# EAGLE board VerdiRT7_MainPCB (EAGLE 8.5.2), part 1 of 2
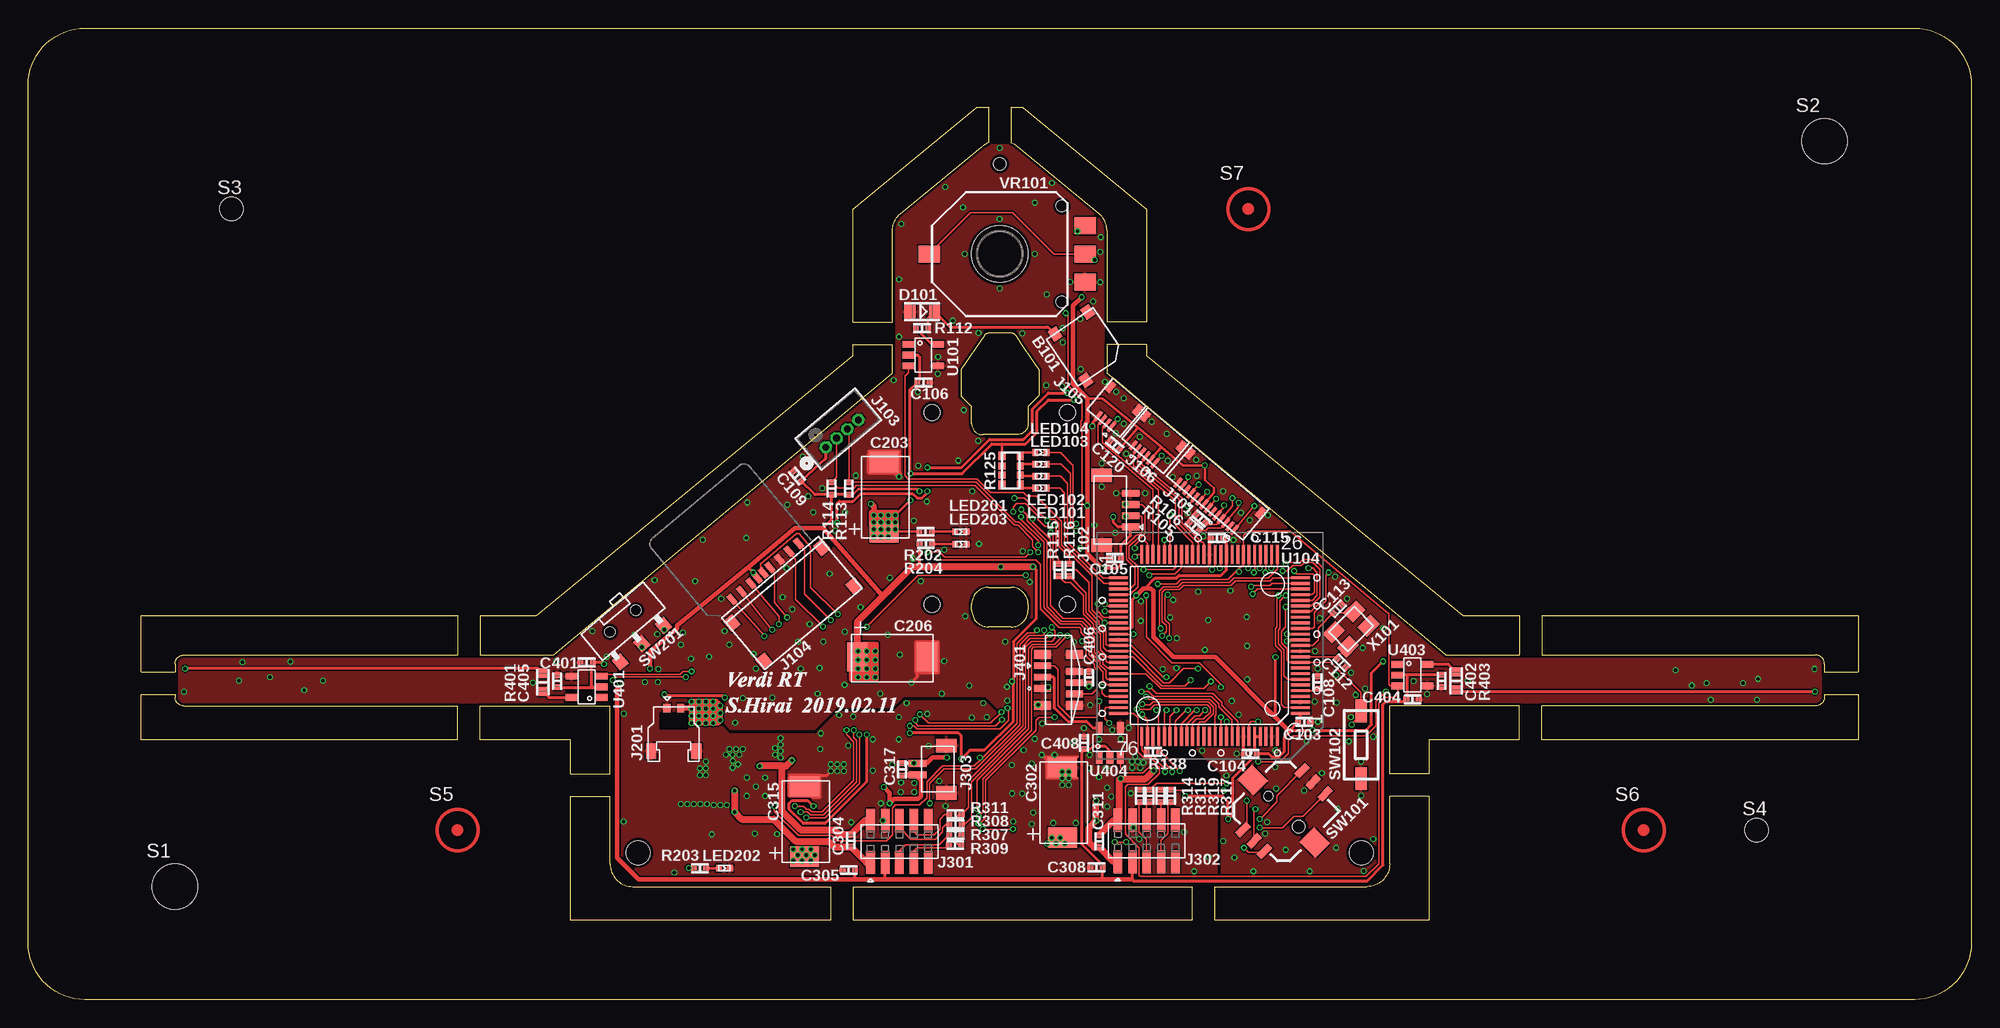
[diagram p6: board, top side]
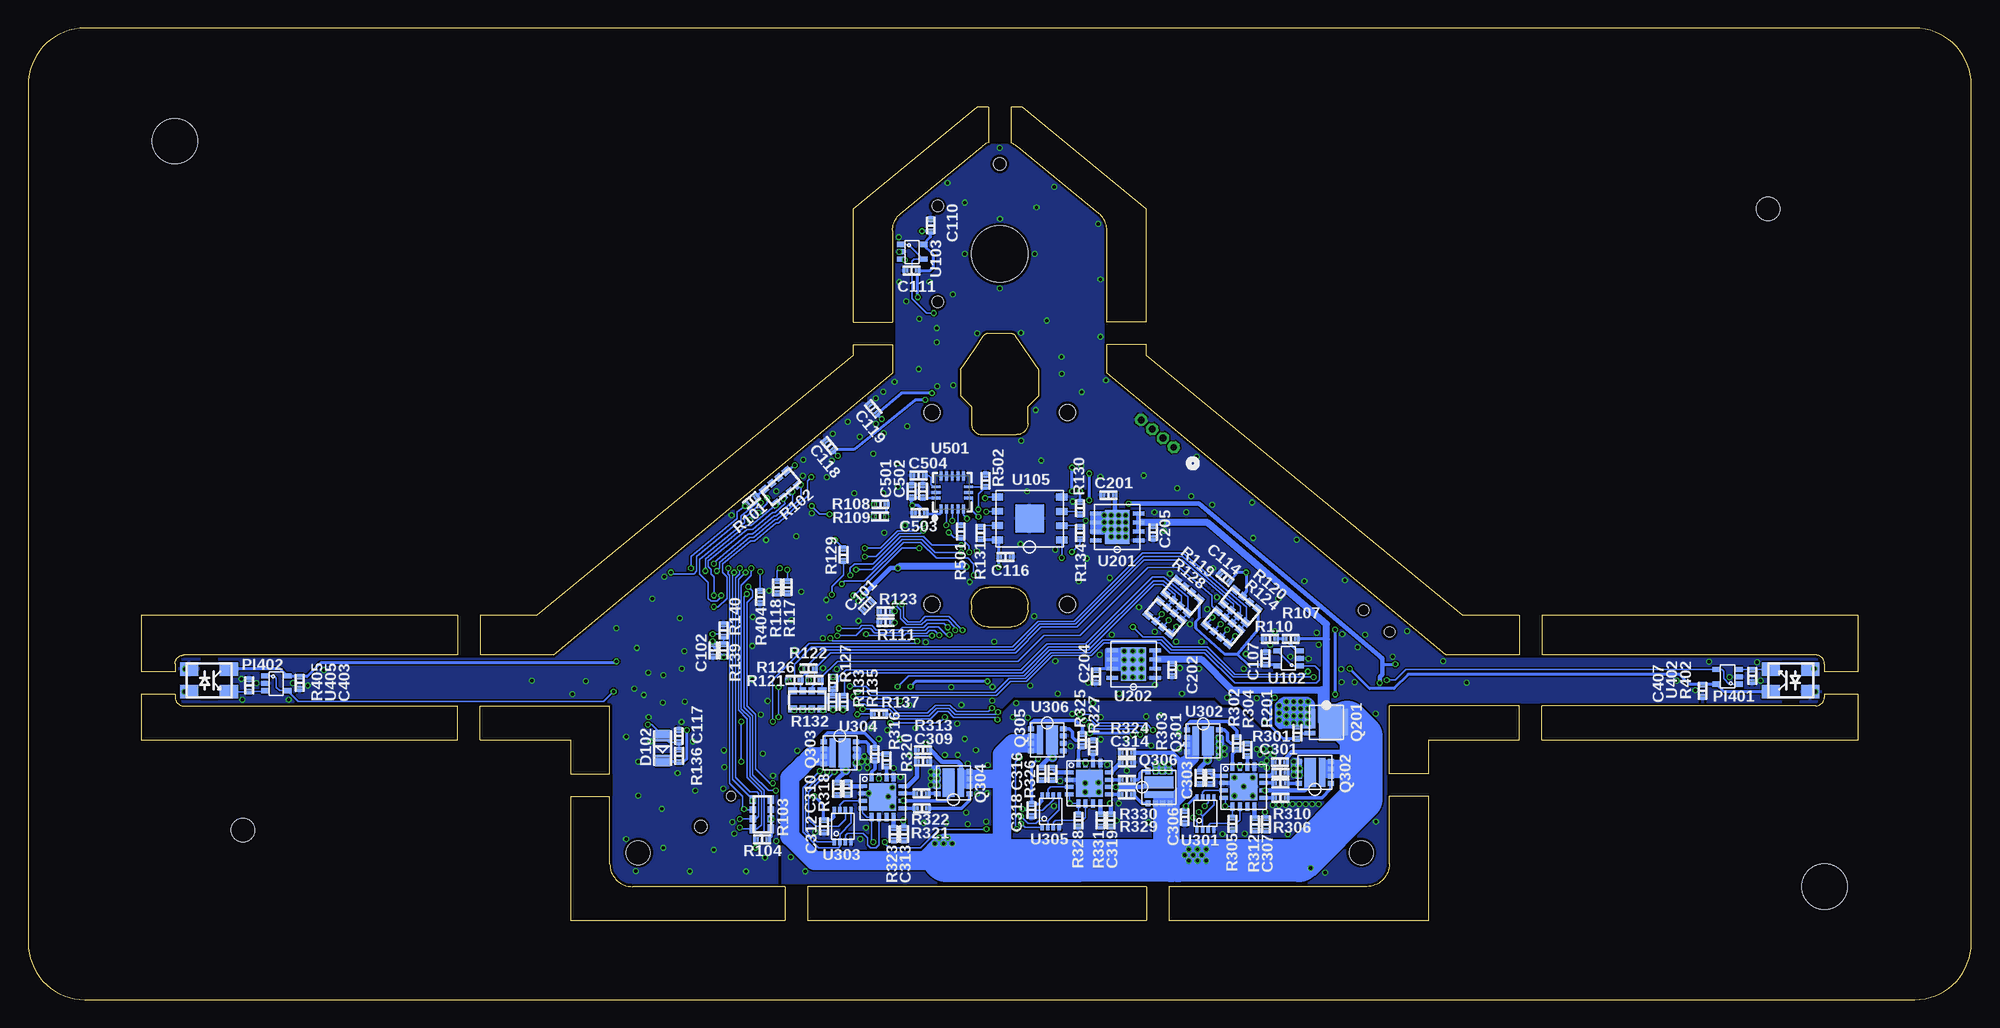
[diagram p7: board, bottom side, seen from below]

Size 172 x 86 mm. Coordinates in mm from the lower left corner, seen from the top.
Outline: 87.52,50.01 84.5,50.01 arc-90 83.51,51 83.51,52.49 82.57,53.43 82.57,55.8 84.63,58.8 arc-53 85.03,59 87.02,59 arc-60 87.42,58.79 arc2 89.48,55.8 89.48,53.46 88.51,52.49 88.51,51 arc-90 87.52,50.01
Outline: 87.52,50.01 arc0 87.52,50.01
Outline: 94.79,69.59 87.57,75.53 arc19 87,75.87 87,79 88,79 99,70 99,60 95.5,60 95.5,68.06 arc50 94.79,69.59
Outline: 120.52,12.01 120.52,18 124,18 124,7 105,7 105,10 118.51,10 arc90 120.52,12.01
Outline: 120.52,20 120.52,26 132,26 132,23 124,23 124,20 120.52,20
Outline: 53.51,10 71,10 71,7 48,7 48,18 51.51,18 51.51,12.01 arc90 53.51,10
Outline: 73,10 103,10 103,7 73,7 73,10
Outline: 51.51,20 51.51,26 40,26 40,23 48,23 48,20 51.51,20
Outline: 77.24,69.59 84.45,75.53 arc-18 85,75.86 85,79 84,79 73,70 73,60 76.5,60 76.5,68.06 arc-52 77.24,69.59
Outline: 88.51,34.99 arc90 87.02,36.49 85.01,36.49 arc90 83.51,34.99 83.51,34.49 arc90 85.01,32.99 87.02,32.99 arc90 88.51,34.49 88.51,34.99
Outline: 13,29.74 13,29 10,29 10,34 38,34 38,30.5 13.76,30.5 arc90 13,29.74
Outline: 13,27 13,26.76 arc90 13.76,26 38,26 38,23 10,23 10,27 13,27
Outline: 159,29.74 arc90 158.24,30.5 134,30.5 134,34 162,34 162,29 159,29 159,29.74
Outline: 159,27 159,26.76 arc-90 158.24,26 134,26 134,23 162,23 162,27 159,27
Outline: 125.47,30.5 132,30.5 132,34 127,34 99,57 99,58 95.5,58 95.5,55.47 125.47,30.5
Outline: 46.53,30.5 76.5,55.47 76.5,58 73,58 73,57 45,34 40,34 40,30.5 46.53,30.5
Outline: 5,86 167,86 arc-90 172,81 172,5 arc-90 167,0 5,0 arc-90 0,5 0,81 arc-90 5,86
Copper layers (1*16): Top 0.035mm / dielectric 1.5mm / Bottom 0.035mm
Design rules "PCBgogo_5mil_drill_0_2mm *": minimum track width 5mil, minimum drill 0.2mm, track to track 5mil, track to pad 5mil, pad to pad 5mil, via to via 5mil, smd to smd 0mil, copper to edge 10mil, drill to drill 6mil, minimum pad ring 6mil, minimum via ring 0.1mm, stop-mask expansion 0.05mm, vias tented up to drill 0mil, thermal gap 6mil
Holes 1.1 mm at 86,73.98
Holes 2.1 mm at 54,13 118,13
Holes 1.4 mm at 80.01,51.99 91.99,51.99 91.99,34.99 80.01,34.99
tRestrict: 26 lines
bRestrict: 24 lines

## Footprints (pad centres in the part's own frame; a part is rotated, then mirrored left to right if it is on the bottom)
SMT-0540-S-R = smd 0.9 x 1.1: + 1.6,-2.45; - 1.6,2.45; NC -1.9,-2.45
1005 = smd 0.5 x 0.5: P$1 -0.55,0; P$2 0.55,0
EEFC_7343 = smd 1.8 x 2.6: MINUS 3.1,0.1; PLUS -3.1,0.1
2012 = smd 1 x 1.3: A -1.1,0; K 1.1,0
1400 = smd 0.3 x 1: 1 -3.25,1.6; 2 -2.75,1.6; 3 -2.25,1.6; 4 -1.75,1.6; 5 -1.25,1.6; 6 -0.75,1.6; 7 -0.25,1.6; 8 0.25,1.6; 9 0.75,1.6; 10 1.25,1.6; 11 1.75,1.6; 12 2.25,1.6; 13 2.75,1.6; 14 3.25,1.6 | smd 0.5 x 1: CASE1 -4.05,-1.05; CASE2 4.05,-1.05
BM04B-SRSS-TB = smd 0.6 x 1.55: 1 -1.5,-1.75; 2 -0.5,-1.75; 3 0.5,-1.75; 4 1.5,-1.75 | smd 1.2 x 1.8: PAD1 -3.1,0.8; PAD2 3.1,0.8
DF13_4P_TH = drill 0.61 pad 1.067 octagon: 1 0,0; 2 -1.245,0; 3 -2.489,0; 4 -3.759,0
MOLEX_105027 = smd 0.5 x 1: 1 3.85,-6.65; 2 2.75,-6.65; 3 1.65,-6.65; 4 0.9,-6.65; 5 -0.55,-6.65; 6 -1.65,-6.65; 7 -2.75,-6.65; 8 -3.85,-6.65; CD 0.2,-6.65 | smd 1.05 x 1.2: GND1 -5.2,-0.6; GND2 5.2,-0.6; GND3 5.2,-5.05; GND4 -5.2,-5.05
0400 = smd 0.3 x 1: 1 -0.75,1.6; 2 -0.25,1.6; 3 0.25,1.6; 4 0.75,1.6 | smd 0.5 x 1: CASE1 -1.55,-1.05; CASE2 1.55,-1.05
0600 = smd 0.3 x 1: 1 -1.25,1.6; 2 -0.75,1.6; 3 -0.25,1.6; 4 0.25,1.6; 5 0.75,1.6; 6 1.25,1.6 | smd 0.5 x 1: CASE1 -2.05,-1.05; CASE2 2.05,-1.05
DF58_2P = smd 0.65 x 0.75: 1 -0.6,2.2; 2 0.6,2.2 | smd 0.9 x 1.4: CASE_1 -2,-1.6; CASE_2 2,-1.6
MA5-2_SMD_1.27MM_MIN = smd 0.76 x 2.05: 1 -2.55,-1.85; 2 -2.55,1.85; 3 -1.25,-1.85; 4 -1.25,1.85; 5 0,-1.85; 6 0,1.85; 7 1.275,-1.85; 8 1.275,1.85; 9 2.55,-1.85; 10 2.55,1.85
BM02B-SRSS-TB = smd 0.6 x 1.55: 1 -0.5,-1.75; 2 0.5,-1.75 | smd 1.2 x 1.8: PAD1 -2.1,0.8; PAD2 2.1,0.8
0652 = smd 0.6 x 1.5: 1 -1.25,-1.4; 2 -0.75,1.4; 3 -0.25,-1.4; 4 0.25,1.4; 5 0.75,-1.4; 6 1.25,1.4 | smd 0.8 x 1.5: CASE1 -2.25,-1.4; CASE2 -2.25,1.4; CASE3 2.25,1.4; CASE4 2.25,-1.4
1005' = smd 0.5 x 0.6: A -0.5,0; K 0.5,0
GP2S700 = smd 1.6 x 1.2: ANODE 1.75,1; CATHODE 1.75,-1; COLLECTOR -1.75,-1; EMITTER -1.75,1
POWERPAK1212-8 = smd 0.95 x 1.7: 1 -1.45,0.325 | smd 0.95 x 0.4: 4 -1.45,-0.975 | smd 0.95 x 2.35: 5 1.45,0 | smd 2 x 3.3: 9 0.325,0
DFN3X3A = smd 0.45 x 0.55: 1 -0.975,-1.425; 2 -0.325,-1.425; 3 0.325,-1.425; 4 0.975,-1.425; 5 0.975,1.425; 6 0.325,1.425; 7 -0.325,1.425; 8 -0.975,1.425 | smd 2.55 x 1.05: PAD_L 0,0.425 | smd 2.55 x 0.55: PAD_S 0,-0.65
3216_ARRAY = smd 0.79 x 0.6: R1-A -1.3,-0.8; R1-B -1.3,0.8; R4-A 1.3,-0.8; R4-B 1.3,0.8 | smd 0.59 x 0.6: R2-A -0.4,-0.8; R2-B -0.4,0.8; R3-A 0.4,-0.8; R3-B 0.4,0.8
1608 = smd 0.8 x 0.8: P$1 -0.8,0; P$2 0.8,0
BASE_HOLE = hole 4: 0,0
GUIDE_HOLE = hole 2.05: 0,0
SKRH = smd 1.8 x 2: 1 0,3.9; 2 0,-3.9 | smd 1.35 x 0.635: A -3.7,1.4; B 3.7,1.4; C -3.7,-1.3; CENTER -3.7,0; COMMON 3.7,0; D 3.7,-1.5 | hole 0.8: 0,1.9 | hole 1.1: 0,-1.9
SKQYA = smd 1 x 2: 1 0,3; 2 0,-3
AYZ0102AGRLC = smd 1 x 1.2: 1 -2.5,2.6; 2 0,2.6; 3 2.5,2.6 | hole 0.9: -1.5,0; 1.5,0
SOT23-5 = smd 0.6 x 1.1: 1 -0.95,-1.3; 2 0,-1.3; 3 0.95,-1.3; 4 0.95,1.3; 5 -0.95,1.3
SOT-70-5 = smd 0.45 x 0.75: 1 0.65,0.95; 2 0,0.95; 3 -0.65,0.95; 4 -0.65,-1; 5 0.65,-1
TQFP100-16X16 = smd 0.25 x 1.7: 1 -6,-8.05; 2 -5.5,-8.05; 3 -5,-8.05; 4 -4.5,-8.05; 5 -4,-8.05; 6 -3.5,-8.05; 7 -3,-8.05; 8 -2.5,-8.05; 9 -2,-8.05; 10 -1.5,-8.05; 11 -1,-8.05; 12 -0.5,-8.05; 13 0,-8.05; 14 0.5,-8.05; 15 1,-8.05; 16 1.5,-8.05; 17 2,-8.05; 18 2.5,-8.05; 19 3,-8.05; 20 3.5,-8.05; 21 4,-8.05; 22 4.5,-8.05; 23 5,-8.05; 24 5.5,-8.05; 25 6,-8.05; 51 6,8.05; 52 5.5,8.05; 53 5,8.05; 54 4.5,8.05; 55 4,8.05; 56 3.5,8.05; 57 3,8.05; 58 2.5,8.05; 59 2,8.05; 60 1.5,8.05; 61 1,8.05; 62 0.5,8.05; 63 0,8.05; 64 -0.5,8.05; 65 -1,8.05; 66 -1.5,8.05; 67 -2,8.05; 68 -2.5,8.05; 69 -3,8.05; 70 -3.5,8.05; 71 -4,8.05; 72 -4.5,8.05; 73 -5,8.05; 74 -5.5,8.05; 75 -6,8.05 | smd 1.7 x 0.25: 26 8.05,-6; 27 8.05,-5.5; 28 8.05,-5; 29 8.05,-4.5; 30 8.05,-4; 31 8.05,-3.5; 32 8.05,-3; 33 8.05,-2.5; 34 8.05,-2; 35 8.05,-1.5; 36 8.05,-1; 37 8.05,-0.5; 38 8.05,0; 39 8.05,0.5; 40 8.05,1; 41 8.05,1.5; 42 8.05,2; 43 8.05,2.5; 44 8.05,3; 45 8.05,3.5; 46 8.05,4; 47 8.05,4.5; 48 8.05,5; 49 8.05,5.5; 50 8.05,6; 76 -8.05,6; 77 -8.05,5.5; 78 -8.05,5; 79 -8.05,4.5; 80 -8.05,4; 81 -8.05,3.5; 82 -8.05,3; 83 -8.05,2.5; 84 -8.05,2; 85 -8.05,1.5; 86 -8.05,1; 87 -8.05,0.5; 88 -8.05,0; 89 -8.05,-0.5; 90 -8.05,-1; 91 -8.05,-1.5; 92 -8.05,-2; 93 -8.05,-2.5; 94 -8.05,-3; 95 -8.05,-3.5; 96 -8.05,-4; 97 -8.05,-4.5; 98 -8.05,-5; 99 -8.05,-5.5; 100 -8.05,-6
8DFN = smd 1 x 0.6: 1 -2.85,1.9; 2 -2.85,0.63; 3 -2.85,-0.64; 4 -2.85,-1.91; 5 2.85,-1.92; 6 2.85,-0.65; 7 2.85,0.62; 8 2.85,1.9 | smd 2.5 x 2.5: PAD 0,0
WFDFN8 = smd 1 x 0.35: 1 -1.9,1.2; 2 -1.9,0.4; 3 -1.9,-0.4; 4 -1.9,-1.2; 5 1.9,-1.2; 6 1.9,-0.4; 7 1.9,0.4; 8 1.9,1.2 | smd 2.2 x 3: PAD 0,0
VSSOP8 = smd 0.6 x 0.3: 1 -1.4,0.75; 2 -1.4,0.25; 3 -1.4,-0.25; 4 -1.4,-0.75; 5 1.4,-0.75; 6 1.4,-0.25; 7 1.4,0.25; 8 1.4,0.75
WQFN16 = smd 0.75 x 0.35: 1 -1.775,0.975; 2 -1.775,0.325; 3 -1.775,-0.325; 4 -1.775,-0.975; 9 1.775,-0.975; 10 1.775,-0.325; 11 1.775,0.325; 12 1.775,0.975 | smd 0.35 x 0.75: 5 -0.975,-1.775; 6 -0.325,-1.775; 7 0.325,-1.775; 8 0.975,-1.775; 13 0.975,1.775; 14 0.325,1.775; 15 -0.325,1.775; 16 -0.975,1.775 | smd 2.4 x 2.4: 17 0,0
LGA16_3X3MM = smd 0.8 x 0.25: 1 -1.45,1; 2 -1.45,0.5; 3 -1.45,0; 4 -1.45,-0.5; 5 -1.45,-1; 9 1.45,-1; 10 1.45,-0.5; 11 1.45,0; 12 1.45,0.5; 13 1.45,1 | smd 0.25 x 0.8: 6 -0.5,-1.45; 7 0,-1.45; 8 0.5,-1.45; 14 0.5,1.45; 15 0,1.45; 16 -0.5,1.45
SV01 = smd 1.5 x 1.9: 1 -2.5,-7.55; 2 2.5,-7.55; 3 0,-7.55; 4 0,6.25 | hole 5: 0,0 | hole 1: -4.25,-5.5; 4.25,-5.5
3225 = smd 1.6 x 1.2: 1 -1.3,-0.9; 2 1.3,-0.9; 3 1.3,0.9; 4 -1.3,0.9

## Placement (x,y rotation side)
B101  SMT-0540-T-7-R  [SMT-0540-S-R]  93.59,57.78 214 top
C101  10V 0.1u  [1005]  97.73,34.87 225 bottom
C102  10V 0.1u  [1005]  111.36,30.92 270 bottom
C103  10V 0.1u  [1005]  112.95,24.57 0 top
C104  10V 0.1u  [1005]  108.2,21.74 180 top
C105  10V 0.1u  [1005]  96.19,39.08 180 top
C106  10V 1u  [1005]  79.25,54.64 0 top
C107  10V 0.1u  [1005]  62.47,30.2 90 bottom
C108  10V 0.1u  [1005]  114.13,28.07 90 top
C109  10V 0.1u  [1005]  68.07,46.35 130 top
C110  10V 0.1u  [1005]  92.11,68.54 90 bottom
C111  10V 0.1u  [1005]  93.81,64.55 180 bottom
C112  10V 10p  [1005]  116.26,29.82 315 top
C113  10V 10p  [1005]  115.9,34.6 45 top
C114  10V 0.1u  [1005]  66.08,37.36 140 bottom
C115  10V 0.1u  [1005]  105.23,40.87 180 top
C116  10V 0.1u  [1005]  85.5,39.2 0 bottom
C117  10V 1u  [1005]  114.41,23.32 90 bottom
C118  10V 1u  [1005]  101.1,49.05 130 bottom
C119  16V 1u  [1005]  97.2,52.3 130 bottom
C120  10V 1u  [1005]  96.18,49.1 140 top
C201  10V 0.1u  [1005]  76.37,44.65 180 bottom
C202  16V 0.1u  [1005]  70.73,29.19 270 bottom
C203  EEF-CS1C330R  [EEFC_7343]  75.85,44.47 90 top
C204  10V 0.1u  [1005]  77.47,28.61 270 bottom
C205  16V 0.1u  [1005]  72.41,41.37 270 bottom
C206  EEF-CS1C330R  [EEFC_7343]  76.48,30.23 0 top
C301  16V 1u  [1005]  61.16,20.08 0 bottom
C302  EEF-CS1C330R  [EEFC_7343]  91.66,17.45 90 top
C303  16V 1u  [1005]  68.31,19.63 90 bottom
C304  50V 0.01u  [1005]  72.82,14.07 270 top
C305  10V 1u  [1005]  72.63,11.46 180 top
C306  10V 0.1u  [1005]  69.63,16.15 270 bottom
C307  16V 1u  [1005]  62.42,15.51 90 bottom
C308  10V 1u  [1005]  94.56,11.69 180 top
C309  16V 1u  [1005]  92.79,21.09 0 bottom
C310  16V 1u  [1005]  100.39,18.66 90 bottom
C311  50V 0.01u  [1005]  94.81,14.02 270 top
C312  10V 0.1u  [1005]  101.56,15.34 270 bottom
C313  16V 1u  [1005]  94.47,14.64 90 bottom
C314  16V 1u  [1005]  74.74,20.98 0 bottom
C315  EEF-CS1C330R  [EEFC_7343]  68.82,15.77 90 top
C316  16V 1u  [1005]  82.3,19.99 90 bottom
C317  50V 0.01u  [1005]  77.35,20.38 270 top
C318  10V 0.1u  [1005]  83.18,16.77 270 bottom
C319  16V 1u  [1005]  76.17,15.85 90 bottom
C401  10V 0.1u  [1005]  49.42,29.86 180 top
C402  10V 1u  [1005]  125.11,28.2 270 top
C403  10V 0.1u  [1005]  147.95,28.05 270 bottom
C404  10V 0.1u  [1005]  122.55,26.59 0 top
C405  10V 1u  [1005]  46.83,28.2 90 top
C406  10V 0.1u  [1005]  93.9,28.5 90 top
C407  10V 0.1u  [1005]  23.78,27.34 270 bottom
C408  10V 0.1u  [1005]  93.44,22.73 90 top
C501  6.3V 1u  [1005]  93.8,45 90 bottom
C502  6.3V 0.1u  [1005]  92.8,45 90 bottom
C503  6.3V 0.1u  [1005]  93.09,43.08 180 bottom
C504  6.3V 0.1u  [1005]  93.2,46.4 180 bottom
D101  1SS352  [2012]  79.13,60.92 0 top
D102  1SS352  [2012]  115.85,22.26 270 bottom
J101  503480_1400  [1400]  105.3,44.9 140 top
J102  BM04B-SRSS-TB(LF)(SN)  [BM04B-SRSS-TB]  95.83,43.33 90 top
J103  DF13-4P-1.25DSA  [DF13_4P_TH]  70.6,48.9 220 top
J104  1050270001  [MOLEX_105027]  69.52,32.81 220 top
J105  503480_0400  [0400]  96.33,52.41 140 top
J106  503480_0600  [0600]  99.8,49.5 140 top
J201  DF58-2P-1.2V(21)  [DF58_2P]  57.14,23.6 0 top
J301  20021321-00010C4LF  [MA5-2_SMD_1.27MM_MIN]  77.11,13.99 0 top
J302  20021321-00010C4LF  [MA5-2_SMD_1.27MM_MIN]  99.01,14.04 0 top
J303  BM02B-SRSS-TB(LF)(SN)  [BM02B-SRSS-TB]  80.47,20.4 270 top
J401  52559-0652  [0652]  91.2,28.3 270 top
LED101  APHHS1005QBC/D  [1005']  89.66,45.29 0 top
LED102  APHHS1005QBC/D  [1005']  89.65,46.33 0 top
LED103  APHHS1005QBC/D  [1005']  89.64,47.4 0 top
LED104  APHHS1005QBC/D  [1005']  89.64,48.44 0 top
LED201  APHHS1005SYCK  [1005']  82.56,41.42 0 top
LED202  APHHS1005ZGC  [1005']  61.63,11.63 0 top
LED203  APHHS1005SYCK  [1005']  82.57,40.31 0 top
PI401  GP2S700HCP  [GP2S700]  15.98,28.24 0 bottom
PI402  GP2S700HCP  [GP2S700]  155.99,28.26 180 bottom
Q201  SISA01DN-T1-GE3  [POWERPAK1212-8]  57.09,24.54 0 bottom
Q301  SIZ322DT-T1-GE3  [DFN3X3A]  68,22.9 270 bottom
Q302  SIZ322DT-T1-GE3  [DFN3X3A]  58.1,20.1 90 bottom
Q303  SIZ322DT-T1-GE3  [DFN3X3A]  100.15,21.85 270 bottom
Q304  SIZ322DT-T1-GE3  [DFN3X3A]  90.1,19.2 90 bottom
Q305  SIZ322DT-T1-GE3  [DFN3X3A]  81.8,23 270 bottom
Q306  SIZ322DT-T1-GE3  [DFN3X3A]  71.9,18.8 0 bottom
R101  10k  [1005]  107.98,44.2 40 bottom
R102  10k  [3216_ARRAY]  105.35,45.36 40 bottom
R103  100k  [3216_ARRAY]  107.06,16.4 270 bottom
R104  100k  [1005]  107.04,14.18 0 bottom
R105  10k  [1005]  103.2,41.9 320 top
R106  10k  [1005]  103.8,42.6 320 top
R107  20k  [1005]  60.24,31.94 0 bottom
R108  20k (DNP)  [1005]  96.57,43.85 0 bottom
R109  20k (DNP)  [1005]  96.6,42.76 0 bottom
R110  10k  [1005]  62.07,31.94 0 bottom
R111  100k  [1005]  96.1,33.41 0 bottom
R112  0  [1005]  79.11,59.43 180 top
R113  20k (DNP)  [1005]  72.64,45.26 270 top
R114  20k (DNP)  [1005]  71.12,45.26 270 top
R115  22  [1005]  91.2,38.03 270 top
R116  22  [1005]  92.16,38.03 270 top
R117  22 (DNP)  [1005]  104.79,36.5 270 bottom
R118  22 (DNP)  [1005]  105.7,36.5 270 bottom
R119  100k  [3216_ARRAY]  69.83,35.69 140 bottom
R120  100k  [3216_ARRAY]  64.69,34.83 140 bottom
R121  22  [1005]  104.19,28.29 180 bottom
R122  22  [1005]  102.92,29.3 180 bottom
R123  22 (DNP)  [1005]  96.12,34.37 0 bottom
R124  22  [3216_ARRAY]  66.24,32.95 320 bottom
R125  10k  [3216_ARRAY]  87.01,46.84 90 top
R126  22  [1005]  102.41,28.29 180 bottom
R127  22  [1005]  100.76,28.03 90 bottom
R128  22  [3216_ARRAY]  71.39,33.83 320 bottom
R129  22  [1005]  99.84,39.38 90 bottom
R130  100k  [1005]  78.9,43.5 90 bottom
R131  100k  [1005]  87.7,41.3 270 bottom
R132  22  [3216_ARRAY]  103.03,26.53 180 bottom
R133  22  [1005]  100.8,26.35 270 bottom
R134  22  [1005]  78.9,41.3 90 bottom
R135  22  [1005]  99.81,26.35 270 bottom
R136  100k  [1005]  114.4,21.57 270 bottom
R137  22  [1005]  96.68,25.27 180 bottom
R138  22  [1005]  99.57,21.92 180 top
R139  100k  [1005]  110.45,30.9 90 bottom
R140  100k (DNP)  [1005]  110.45,32.69 90 bottom
R201  20k  [1005]  59.66,23.63 90 bottom
R202  4.7k  [1005]  79.44,41.42 180 top
R203  4.7k  [1005]  59.46,11.63 180 top
R204  4.7k  [1005]  79.45,40.35 180 top
R301  2.2  [1005]  61.19,21.02 0 bottom
R302  2.2  [1005]  65.02,22.67 270 bottom
R303  1  [1005]  67.38,19.62 90 bottom
R304  0  [1005]  64.08,22.11 270 bottom
R305  100k  [1005]  65.41,15.57 270 bottom
R306  2.2  [1005]  61.15,17.85 180 bottom
R307  0 (DNP)  [1005]  82.07,14.6 0 top
R308  0  [1005]  82.08,15.51 0 top
R309  0 (DNP)  [1005]  82.06,13.68 0 top
R310  0  [1005]  61.14,19.15 180 bottom
R311  0  [1005]  82.07,16.39 0 top
R312  1  [1005]  63.41,15.51 90 bottom
R313  2.2  [1005]  92.79,22.08 0 bottom
R314  0 (DNP)  [1005]  98.4,18.04 90 top
R315  0  [1005]  99.26,18.05 90 top
R316  2.2  [1005]  97.06,21.73 270 bottom
R317  0  [1005]  101.14,18.03 90 top
R318  1  [1005]  99.48,18.68 90 bottom
R319  0 (DNP)  [1005]  100.22,18.04 90 top
R320  0  [1005]  96.04,21.17 270 bottom
R321  2.2  [1005]  92.9,16.94 180 bottom
R322  0  [1005]  92.92,18.24 180 bottom
R323  1  [1005]  95.39,14.65 90 bottom
R324  2.2  [1005]  74.74,21.85 0 bottom
R325  2.2  [1005]  78.7,22.97 270 bottom
R326  1  [1005]  81.34,19.98 90 bottom
R327  0  [1005]  77.74,22.39 270 bottom
R328  100k  [1005]  79.05,15.85 270 bottom
R329  2.2  [1005]  74.76,18.17 180 bottom
R330  0  [1005]  74.75,19.47 180 bottom
R331  1  [1005]  77.07,15.87 90 bottom
R401  51  [1608]  45.55,28.1 270 top
R402  3k  [1005]  19.39,28.66 90 bottom
R403  51  [1608]  126.4,28.2 90 top
R404  100k  [1005]  107.2,35.63 90 bottom
R405  3k  [1005]  152.45,27.82 270 bottom
R501  22  [1005]  89.45,41.45 270 bottom
R502  100k  [1005]  87.25,45.94 270 bottom
S1  BASE_HOLE  [BASE_HOLE]  13,10 0 top
S2  BASE_HOLE  [BASE_HOLE]  159,76 0 top
S3  GUIDE_HOLE_1  [GUIDE_HOLE]  18,70 0 top
S4  GUIDE_HOLE_2  [GUIDE_HOLE]  153,15 0 top
S5  RECOG_MARK_1  [RECOG_MARK]  38,15 0 top
S6  RECOG_MARK_2  [RECOG_MARK]  143,15 0 top
S7  RECOG_MARK_3  [RECOG_MARK]  108,70 0 top
SW101  SKRHABE010  [SKRH]  111.13,16.66 45 top
SW102  SKQYACE010  [SKQYA]  117.99,22.55 0 top
SW201  AYZ0102AGRLC  [AYZ0102AGRLC]  52.64,33.51 220 top
U101  MCP1416T-E/OT  [SOT23-5]  79.23,57.06 270 top
U102  MCP6001T-I/LT  [SOT-70-5]  60.41,30.2 270 bottom
U103  MCP6001T-I/LT  [SOT-70-5]  93.78,66.21 90 bottom
U104  R5F564MLDDFP#V1-ND  [TQFP100-16X16]  104.57,31.35 90 top
U105  MR20H40CDF  [8DFN]  83.35,42.58 180 bottom
U201  TLV1117-50CDRJR  [WFDFN8]  75.6,41.83 180 bottom
U202  TLV1117-33CDRJR  [WFDFN8]  74.15,29.69 180 bottom
U301  74LVC2G08DC  [VSSOP8]  67.79,16.47 90 bottom
U302  RT9625AZQW  [WQFN16]  64.41,18.84 0 bottom
U303  74LVC2G08DC  [VSSOP8]  99.91,15.35 90 bottom
U304  RT9625AZQW  [WQFN16]  96.36,17.92 0 bottom
U305  74LVC2G08DC  [VSSOP8]  81.5,16.66 90 bottom
U306  RT9625AZQW  [WQFN16]  78.07,19.14 0 bottom
U401  MCP1416T-E/OT  [SOT23-5]  49.41,27.69 90 top
U402  MCP6001T-I/LT  [SOT-70-5]  21.55,28.57 270 bottom
U403  MCP1416T-E/OT  [SOT23-5]  122.53,28.73 270 top
U404  MCP1416T-E/OT  [SOT23-5]  95.75,22.73 0 top
U405  MCP6001T-I/LT  [SOT-70-5]  150.07,28 90 bottom
U501  ICM-20602  [LGA16_3X3MM]  90.2,44.9 90 bottom
VR101  SV01A103AEA01  [SV01]  86,66.01 90 top
X101  NX3225SA-12.000M-STD-CSR-1  [3225]  117.11,32.81 225 top